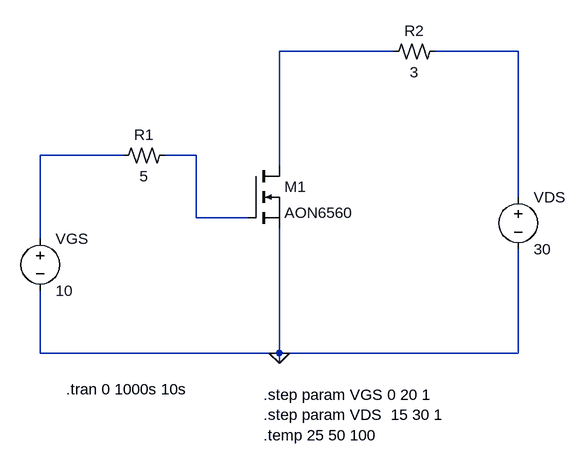
[diagram p0: schematic Dig Electronic Circuit Design.asc]
Dig Electronic Circuit Design.asc, the LTspice schematic file:
Version 4
SHEET 1 1128 680
WIRE 864 -32 688 -32
WIRE 1056 -32 928 -32
WIRE 448 128 320 128
WIRE 560 128 512 128
WIRE 688 144 688 -32
WIRE 1056 192 1056 -32
WIRE 560 224 560 128
WIRE 640 224 560 224
WIRE 320 256 320 128
WIRE 320 432 320 336
WIRE 688 432 688 240
WIRE 688 432 320 432
WIRE 1056 432 1056 272
WIRE 1056 432 688 432
WIRE 688 448 688 432
FLAG 688 432 0
SYMBOL nmos 640 144 R0
SYMATTR InstName M1
SYMATTR Value AON6560
SYMBOL res2 512 112 R90
WINDOW 0 0 32 VBottom 2
WINDOW 3 32 32 VTop 2
SYMATTR InstName R1
SYMATTR Value 5
SYMBOL res2 928 -48 R90
WINDOW 0 0 32 VBottom 2
WINDOW 3 32 32 VTop 2
SYMATTR InstName R2
SYMATTR Value 3
SYMBOL voltage 320 240 R0
SYMATTR InstName VGS
SYMATTR Value 10
SYMBOL voltage 1056 176 R0
SYMATTR InstName VDS
SYMATTR Value 30
TEXT 360 488 Left 2 !.tran 0 1000s 10s
TEXT 664 496 Left 2 !.step param VGS 0 20 1\n.step param VDS  15 30 1\n.temp 25 50 100

The netlist it stands for:
* Dig Electronic Circuit Design.asc
M1 N001 N004 0 0 AON6560
R1 N004 N003 5
R2 N002 N001 3
VGS N003 0 10
VDS N002 0 30
.model NMOS NMOS
.model PMOS PMOS
.lib standard.mos
.tran 0 1000s 10s
.step param VGS 0 20 1
.step param VDS  15 30 1
.temp 25 50 100
.backanno
.end